# Altium schematic sheet PCB_LED_CALENDAR__ESP-12E.SchDoc
size A3
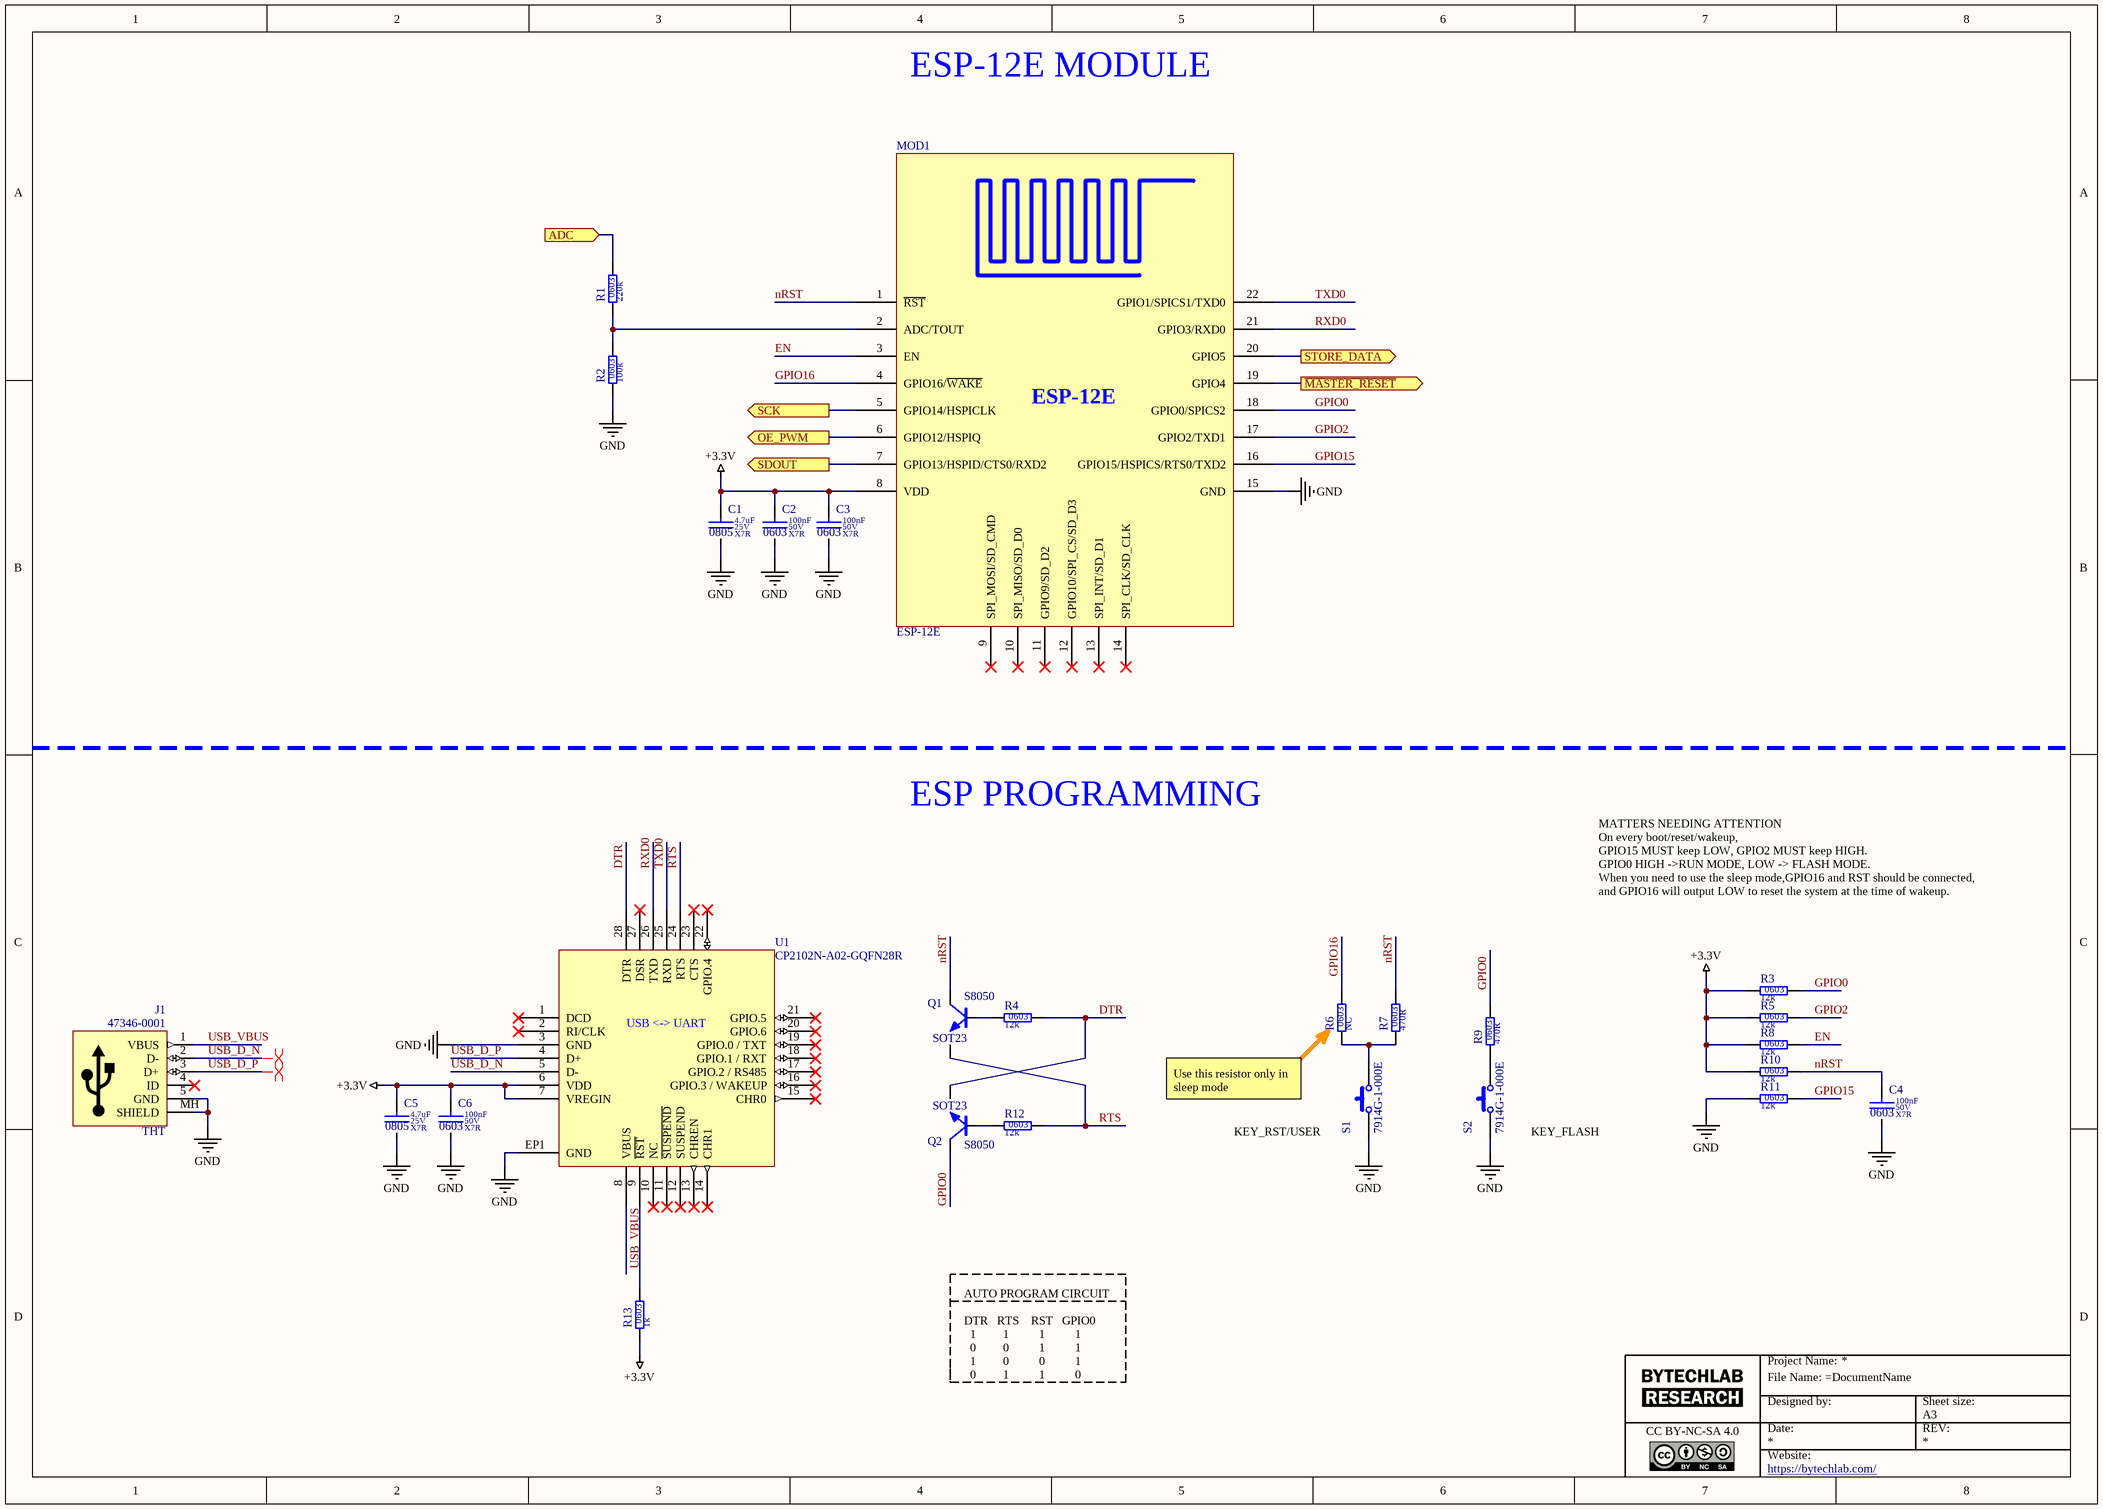
[diagram p0: PCB_LED_CALENDAR__ESP-12E.SchDoc]

## Parts
C1  value 4.7uF  Dielectric: X7R  Voltage: 25V  SCH_Footprint: 0805  [C_0805_2012]  (hidden comment: Ceramic X7R)
C2  value 100nF  Dielectric: X7R  Voltage: 50V  SCH_Footprint: 0603  [C_0603_1608]  (hidden comment: Ceramic X7R)
C3  value 100nF  Dielectric: X7R  Voltage: 50V  SCH_Footprint: 0603  [C_0603_1608]  (hidden comment: Ceramic X7R)
C4  value 100nF  Dielectric: X7R  Voltage: 50V  SCH_Footprint: 0603  [C_0603_1608]  (hidden comment: Ceramic X7R)
C5  value 4.7uF  Dielectric: X7R  Voltage: 25V  SCH_Footprint: 0805  [C_0805_2012]  (hidden comment: Ceramic X7R)
C6  value 100nF  Dielectric: X7R  Voltage: 50V  SCH_Footprint: 0603  [C_0603_1608]  (hidden comment: Ceramic X7R)
J1  value 47346-0001  SCH_Footprint: THT  [J_USB_MICROB_47346-0001]  (hidden comment: USB connector)
MOD1  ESP-12E  [ESP-12E]
Q1  S8050  SCH_Footprint: SOT23  [SOT-23]
Q2  S8050  SCH_Footprint: SOT23  [SOT-23]
R1  value 220k  SCH_Footprint: 0603  [R_0603_1608]  (hidden comment: Resistor)
R2  value 100k  SCH_Footprint: 0603  [R_0603_1608]  (hidden comment: Resistor)
R3  value 12k  SCH_Footprint: 0603  [R_0603_1608]  (hidden comment: Resistor)
R4  value 12k  SCH_Footprint: 0603  [R_0603_1608]  (hidden comment: Resistor)
R5  value 12k  SCH_Footprint: 0603  [R_0603_1608]  (hidden comment: Resistor)
R6  value NC  SCH_Footprint: 0603  [R_NC_0603_1608]  (hidden comment: Resistor)
R7  value 470R  SCH_Footprint: 0603  [R_0603_1608]  (hidden comment: Resistor)
R8  value 12k  SCH_Footprint: 0603  [R_0603_1608]  (hidden comment: Resistor)
R9  value 470R  SCH_Footprint: 0603  [R_0603_1608]  (hidden comment: Resistor)
R10  value 12k  SCH_Footprint: 0603  [R_0603_1608]  (hidden comment: Resistor)
R11  value 12k  SCH_Footprint: 0603  [R_0603_1608]  (hidden comment: Resistor)
R12  value 12k  SCH_Footprint: 0603  [R_0603_1608]  (hidden comment: Resistor)
R13  value 1k  SCH_Footprint: 0603  [R_0603_1608]  (hidden comment: Resistor)
S1  7914G-1-000E  [7914G-1-000E]
S2  7914G-1-000E  [7914G-1-000E]
U1  CP2102N-A02-GQFN28R  [QFN28]

## Ports
ADC (in), OE_PWM (out), SCK (out), SDOUT (out), STORE_DATA (out), ~{MASTER_RESET} (out)

## Nets
+3.3V: C1.1 C2.1 C3.1 C5.1 C6.1 MOD1.8(VDD) R3.1 R5.1 R8.1 R10.1 R13.1 U1.6(VDD) U1.7(VREGIN)
GND: C1.2 C2.2 C3.2 C4.2 C5.2 C6.2 J1.5(GND) J1.MH(SHIELD) MOD1.15(GND) R2.1 R11.1 S1.1 S2.1 U1.3(GND) U1.EP1(GND)
~{MASTER_RESET}: MOD1.19(GPIO4) ; port ~{MASTER_RESET}
ADC: R1.2 ; port ADC
DTR: Q2.E R4.2 U1.28(DTR)
EN: MOD1.3(EN) R8.2
GPIO0: MOD1.18(GPIO0/SPICS2) Q2.C R3.2 R9.2
GPIO2: MOD1.17(GPIO2/TXD1) R5.2
GPIO15: MOD1.16(GPIO15/HSPICS/RTS0/TXD2) R11.2
GPIO16: MOD1.4(GPIO16/~{WAKE}) R6.2
nRST: C4.1 MOD1.1(~{RST}) Q1.C R7.2 R10.2
OE_PWM: MOD1.6(GPIO12/HSPIQ) ; port OE_PWM
RTS: Q1.E R12.2 U1.24(RTS)
RXD0: MOD1.21(GPIO3/RXD0) U1.26(TXD)
SCK: MOD1.5(GPIO14/HSPICLK) ; port SCK
SDOUT: MOD1.7(GPIO13/HSPID/CTS0/RXD2) ; port SDOUT
STORE_DATA: MOD1.20(GPIO5) ; port STORE_DATA
TXD0: MOD1.22(GPIO1/SPICS1/TXD0) U1.25(RXD)
USB_D_N: J1.2(D-) U1.5(D-)
USB_D_P: J1.3(D+) U1.4(D+)
USB_VBUS: J1.1(VBUS) U1.8(VBUS)
NetMOD1_2: MOD1.2(ADC/TOUT) R1.1 R2.2
NetQ1_B: Q1.B R4.1
NetQ2_B: Q2.B R12.1
NetR6_1: R6.1 R7.1 S1.2
NetR9_1: R9.1 S2.2
NetR13_2: R13.2 U1.9(~{RST})

Not connected (* = marked no-connect by the designer): J1 4(ID)*; MOD1 9(SPI_MOSI/SD_CMD)* 10(SPI_MISO/SD_D0)* 11(GPIO9/SD_D2)* 12(GPIO10/SPI_CS/SD_D3)* 13(SPI_INT/SD_D1)* 14(SPI_CLK/SD_CLK)*; U1 1(DCD)* 2(RI/CLK)* 10(NC)* 11(~{SUSPEND})* 12(SUSPEND)* 13(CHREN)* 14(CHR1)* 15(CHR0)* 16(GPIO.3_/_WAKEUP)* 17(GPIO.2_/_RS485)* 18(GPIO.1_/_RXT)* 19(GPIO.0_/_TXT)* 20(GPIO.6)* 21(GPIO.5)* 22(GPIO.4)* 23(CTS)* 27(DSR)*

## Layout directives
differential pair: USB_D_N, USB_D_P

## Notes on the sheet
- ESP-12E MODULE
- ESP PROGRAMMING
- MATTERS NEEDING ATTENTION
  On every boot/reset/wakeup,
  GPIO15 MUST keep LOW, GPIO2 MUST keep HIGH.
  GPIO0 HIGH ->RUN MODE, LOW -> FLASH MODE.
  When you need to use the sleep mode,GPIO16 and RST should be connected,
  and GPIO16 will output LOW to reset the system at the time of wakeup.
- Use this resistor only in sleep mode
- (near S1) KEY_RST/USER
- (near S2) KEY_FLASH
- AUTO PROGRAM CIRCUIT
  DTR   RTS    RST   GPIO0
  1         1          1          1
  0         0          1          1
  1         0          0          1
  0         1          1          0
- Project Name:
- File Name: =DocumentName
- CC BY-NC-SA 4.0
- Designed by:
- Date:
- Website:
- Sheet size:
- A3
- REV:
- https://bytechlab.com/
- (in symbol U_CP2102N-A02-GQFN28R) USB <-> UART

## Library data of the parts
C1 C5 = C_4.7uF_25V_X7R_0805_10: Capacitor; Manufacturer: TDK; Manufacturer Part Number: CGA4J1X7R1E475K125AC; Tolerance (%): 10; Part Number: C_4.7uF_25V_X7R_0805_10; HelpURL: https://product.tdk.com/info/en/catalog/datasheets/mlcc_automotive_general_en.pdf; Supplier 1: TME; Supplier 2: RS Components; Supplier Part Number 2: 9155187P; Supplier 3: Farnell; Supplier Part Number 3: 2346968; Supplier 4: Mouser; Supplier Part Number 4: 810-CGA4J1X7R1E475K; Supplier 5: Digi-Key; Supplier Part Number 5: 445-6967-1-ND; Supplier 6: LCSC; Supplier 7: Avnet; Supplier Part Number 7: CGA4J1X7R1E475K125AC
C2-C4 C6 = C_100nF_50V_X7R_0603_5: Capacitor; Manufacturer: Samsung; Manufacturer Part Number: CL10B104JB8NNNC; Tolerance (%): 5; Part Number: C_100nF_50V_X7R_0603_5; HelpURL: http://www.tme.eu/pl/Document/4a42202b32dab16128fe107dd69598cc/samsung-chip-cap.pdf; Supplier 1: TME; Supplier Part Number 1: CL10B104JB8NNNC; Supplier 2: RS Components; Supplier Part Number 2: 7665455; Supplier 3: Farnell; Supplier 4: Mouser; Supplier 5: Digi-Key; Supplier Part Number 5: 1276-1033-1-ND; Supplier 6: LCSC; Supplier Part Number 6: C24452
J1 = J_USB_MICROB_47346-0001: USB A THT Connector; Manufacturer: Molex; Part Number: J_USB_MICROB_47346-0001; HelpURL: http://www.farnell.com/datasheets/2214755.pdf?_ga=2.122698443.1358013891.1513863851-953128292.1508669538; Manufacturer Part Number: 47346-0001; Supplier 1: TME; Supplier 2: RS Components; Supplier 3: Farnell; Supplier Part Number 3: 1568026; Supplier 4: Mouser; Supplier Part Number 4: 538-47346-0001; Supplier 5: Digi-Key; Supplier 6: LCSC
MOD1 = MOD_ESP_12_E: ESP-12E Wi-Fi Module by AI-Thinker; Manufacturer Part Number: ESP-12E; Manufacturer: Ai-thinker; Supplier 1: JLCPCB; Supplier Part Number 1: C89297
Q1 Q2 = QNP_S8050: 25V 300mW 500mA NPN SOT-23 Bipolar (BJT) ROHS; Manufacturer: FUXINSEMI; Manufacturer Part Number: S8050; Supplier 1: JLCPCB; Supplier Part Number 1: C908252
R1 = R_220k_0603_1: Manufacturer: Vishay; Manufacturer Part Number: CRCW0603220KFKTABC; Voltage: 75V; Power: 100mW; Tolerance: 1%; Part Number: R_220k_0603_1; HelpURL: https://www.tme.eu/Document/622e28308c06d160637f2b14751ba16b/Data%20Sheet%20CRCW_BCe3.pdf; Supplier 1: TME; Supplier Part Number 1: CRCW0603220KFKTABC; Supplier 2: RS Components; Supplier 3: Farnell; Supplier 4: Mouser; Supplier 5: Digi-Key; Supplier 6: LCSC
R2 = R_100k_0603_1: Manufacturer: Royalohm; Manufacturer Part Number: 0603SAF1003T5E; Voltage: 50V; Power: 100mW; Tolerance: 1%; Part Number: R_100k_0603_1; HelpURL: http://www.tme.eu/pl/Document/b315665a56acbc42df513c99b390ad98/ROYALOHM-THICKFILM.pdf; Supplier 1: TME; Supplier Part Number 1: SMD0603-100K-1%; Supplier 2: RS Components; Supplier 3: Farnell; Supplier 4: Mouser; Supplier Part Number 4: 667-ERJ-3EKF1003V; Supplier 5: Digi-Key; Supplier Part Number 5: P100KHCT-ND; Supplier 6: LCSC
R3-R5 R8 R10-R12 = R_12k_0603_1: Manufacturer: Yageo; Manufacturer Part Number: RC0603FR-0712KL; Voltage: 50V; Power: 100mW; Tolerance: 1%; Part Number: R_12k_0603_1; HelpURL: http://www.tme.eu/pl/Document/d2a72e545e5c8eb7bf2a04fa97535928/rc0603yageo.pdf; Supplier 1: TME; Supplier Part Number 1: RC0603FR-0712K; Supplier 2: RS Components; Supplier 3: Farnell; Supplier Part Number 3: 2693657; Supplier 4: Mouser; Supplier Part Number 4: 603-RC0603FR-0712KL; Supplier 5: Digi-Key; Supplier Part Number 5: 311-12.0KHRCT-ND; Supplier 6: LCSC
R6 = R_GENERIC_0603: Part Number: R_GENERIC_0603; HelpURL: -; Manufacturer: -; Manufacturer Part Number: -; Supplier 1: TME; Supplier 2: RS Components; Supplier 3: Farnell; Supplier 4: Mouser; Supplier 5: Digi-Key; Supplier 6: LCSC
R7 R9 = R_470R_0603_1: Manufacturer: Yageo; Manufacturer Part Number: RC0603FR-07470RL; Voltage: 50V; Power: 100mW; Tolerance: 1%; Part Number: R_470R_0603_1; HelpURL: http://www.tme.eu/en/Document/9fef8ccbb584e9f6a1c931cf356afd5c/PYu-RC0603_51_RoHS_L_4.pdf; Supplier 1: TME; Supplier Part Number 1: RC0603FR-07470R; Supplier 2: RS Components; Supplier 3: Farnell; Supplier Part Number 3: 9238441; Supplier 4: Mouser; Supplier Part Number 4: 603-RC0603FR-07470RL; Supplier 5: Digi-Key; Supplier Part Number 5: 311-470HRCT-ND; Supplier 6: LCSC
R13 = R_1k_0603_1: Manufacturer: Vishay; Manufacturer Part Number: CRCW06031K00FKEA; Voltage: 75V; Power: 100mW; Tolerance: 1%; Part Number: R_1k_0603_1; HelpURL: http://www.farnell.com/datasheets/2310790.pdf?_ga=2.256888843.1690599162.1548417389-1379097396.1542296996&_gac=1.262631934.1547230258.Cj0KCQiAmuHhBRD0ARIsAFWyPwhX8HcvXnM3tA0ZBodZLzDIjH2ZxLpjT5LWo9bad_HPRbU8LfPq44UaAhEwEALw_wcB; Supplier 1: TME; Supplier 2: RS Components; Supplier Part Number 2: 678-9875P; Supplier 3: Farnell; Supplier Part Number 3: 1469740; Supplier 4: Mouser; Supplier Part Number 4: 71-CRCW0603-1.0K-E3; Supplier 5: Digi-Key; Supplier Part Number 5: 541-1.00KHCT-ND; Supplier 6: LCSC
S1 S2 = S_7914G-1-000E: Tact Switch; Manufacturer: BOURNS; Manufacturer Part Number: 7914G-1-000E; Supplier 1: JLCPCB; Supplier Part Number 1: C840653
U1 = U_CP2102N-A02-GQFN28R: USB to UART UART QFN-28-EP(5x5) USB Converters ROHS; Manufacturer: SKYWORKS/SILICON LABS; Manufacturer Part Number: CP2102N-A02-GQFN28R; Supplier 1: JLCPCB; Supplier Part Number 1: C964632